# EAGLE design NinjaLAMP_Arduino (EAGLE 9.6.1)
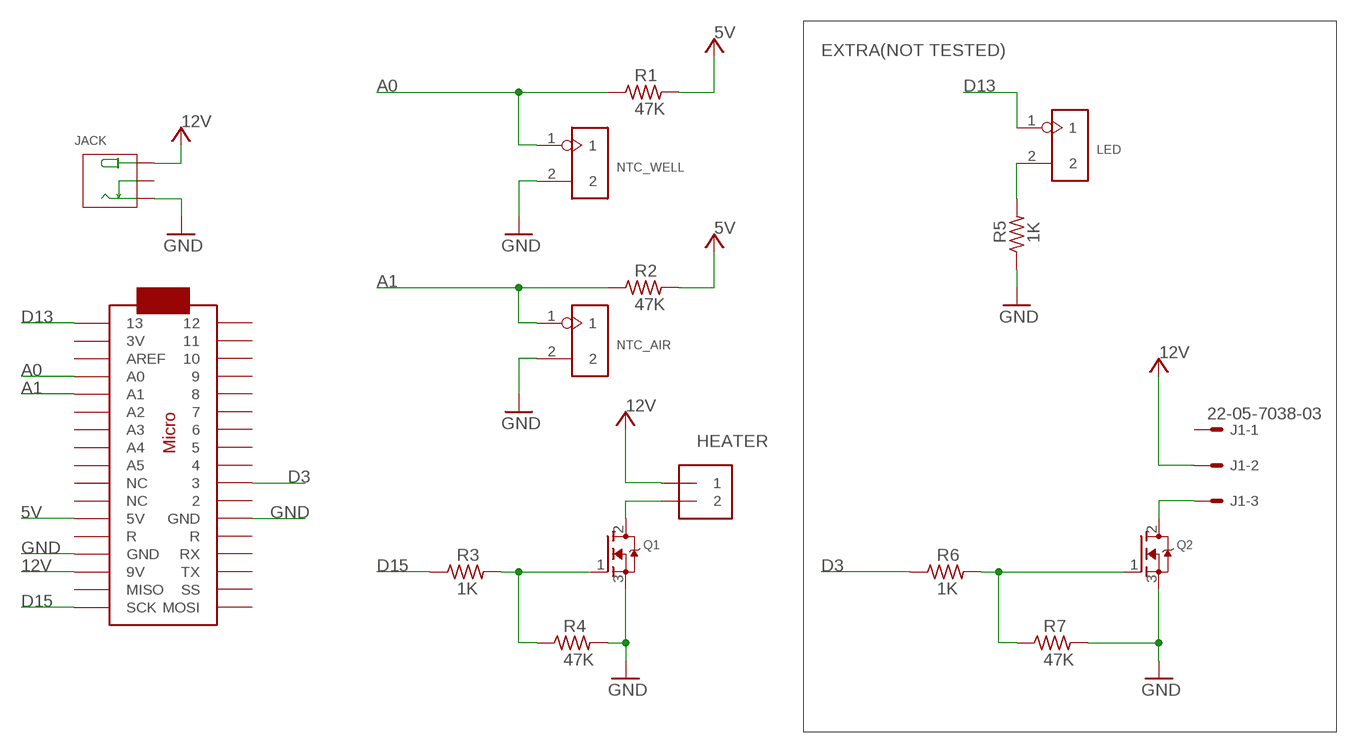
[diagram p0: schematic, sheet 1]

## Parts
HEATER  1X2-3.5MM  [1X2-3.5MM]
J1  22-05-7038-03  [7395-03]
JACK  DC-005  CONN-POWER-JACK-2.1MM(DC-005)  [DCJ3P-14.2X11.0X9.0MM]
LED  2p-2.54  DIP-BLACK-MALE-HEADER-VERT(2P-2.54)  [H2-2.54]
NTC_AIR  2p-2.54  DIP-BLACK-MALE-HEADER-VERT(2P-2.54)  [H2-2.54]
NTC_WELL  2p-2.54  DIP-BLACK-MALE-HEADER-VERT(2P-2.54)  [H2-2.54]
Q1  MOSFET-NGDS_TO220V  [TO220V]
Q2  MOSFET-NGDS_TO220V  [TO220V]
R1  47K  R-US_0204/7  [0204/7]
R2  47K  R-US_0204/7  [0204/7]
R3  1K  R-US_0204/7  [0204/7]
R4  47K  R-US_0204/7  [0204/7]
R5  1K  R-US_0204/7  [0204/7]
R6  1K  R-US_0204/7  [0204/7]
R7  47K  R-US_0204/7  [0204/7]
U$2  ARDUINOMICRO  [ARDUINOMICRO]

## Nets
5V: R1.2 R2.2 U$2.P$23(5V)
12V: HEATER.1 J1.2 JACK.+B(+) JACK.+T(+) U$2.P$20(9V)
A0: NTC_WELL.1 R1.1 U$2.P$31(A0)
A1: NTC_AIR.1 R2.1 U$2.P$30(A1)
D3: R6.1 U$2.P$10
D13: LED.1 U$2.P$34
D15: R3.1 U$2.P$18(SCK)
DRAIN: HEATER.2 Q1.2(D)
GATE: Q1.1(G) R3.2 R4.1
GND: JACK.-1B(-) JACK.-1T(-) NTC_AIR.2 NTC_WELL.2 Q1.3(S) Q2.3(S) R4.2 R5.1 R7.2 U$2.P$12(GND) U$2.P$21(GND)
N$2: LED.2 R5.2
N$3: Q2.1(G) R6.2 R7.1
N$6: J1.3 Q2.2(D)
Unconnected: J1.1 JACK.-2(CDN) JACK.-2B(CDN) U$2.P$1 U$2.P$2 U$2.P$3 U$2.P$4 U$2.P$5 U$2.P$6 U$2.P$7 U$2.P$8 U$2.P$9 U$2.P$11 U$2.P$13(R) U$2.P$14(RX) U$2.P$15(TX) U$2.P$16(SS) U$2.P$17(MOSI) U$2.P$19(MISO) U$2.P$22(R) U$2.P$24(NC) U$2.P$25(NC) U$2.P$26(A5) U$2.P$27(A4) U$2.P$28(A3) U$2.P$29(A2) U$2.P$32(AREF) U$2.P$33(3V)

## Notes on the sheet
- EXTRA(NOT TESTED)
- HEATER

## Library data of the parts
HEATER = adafruit:1X2: 3.5mm Terminal block http://www.ladyada.net/library/pcb/eaglelibrary.html
J1 = con-molex:22-?-03: CONNECTOR wire to board 2.54 mm (.1 inch) pitch header; MF: MOLEX; OC_FARNELL: unknown; OC_NEWARK: unknown
JACK = OPL_Connector:CONN-POWER-JACK-2.1MM(DC-005): Seeed SKU 320120003 - DIP Black DC Jack 2.1MM MPN: DC-005 Important Notes: This part requires milling slots. Please make sure layer 46 Milling is included in the profile or outline layer when exporting Gerber files. Alternatively, you can use the built-in Seeed Fusion CAM file. Find it under Third-Party CAM files. Seeed Fusion PCBA OPL <https://www.seeedstudio.com/opl.html> Order PCB/PCBA Now <https://www.seeedstudio.com/fusion_pcb.html> www.seeedstudio.com; MPN: DC-005
LED NTC_AIR NTC_WELL = OPL_Connector:DIP-BLACK-MALE-HEADER-VERT(2P-2.54): 320020016; MPN: P125-1102A0BS116A1
Q1 Q2 = adafruit:MOSFET-N: N-Channel Mosfet 2N7002E - 60V 260mA SOT23 [Digikey: 2N7002ET1GOSTR-ND] - REEL BSH103 - 30V 850mA SOT23 [Digikey: 568-5013-1-ND]
R1-R7 = resistor:R-US_: RESISTOR, American symbol
U$2 = adafruit:ARDUINOMICRO

## Board
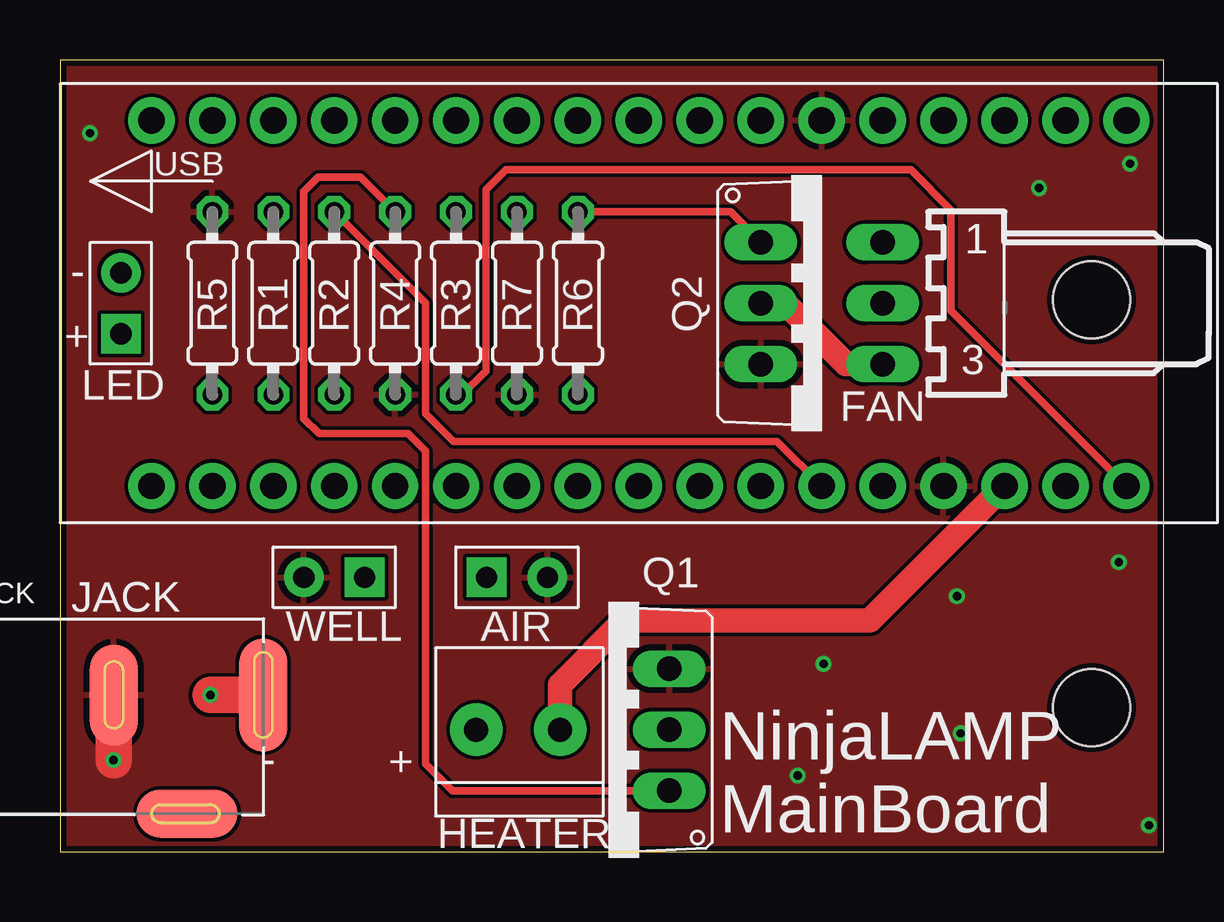
[diagram p1: board, top side]
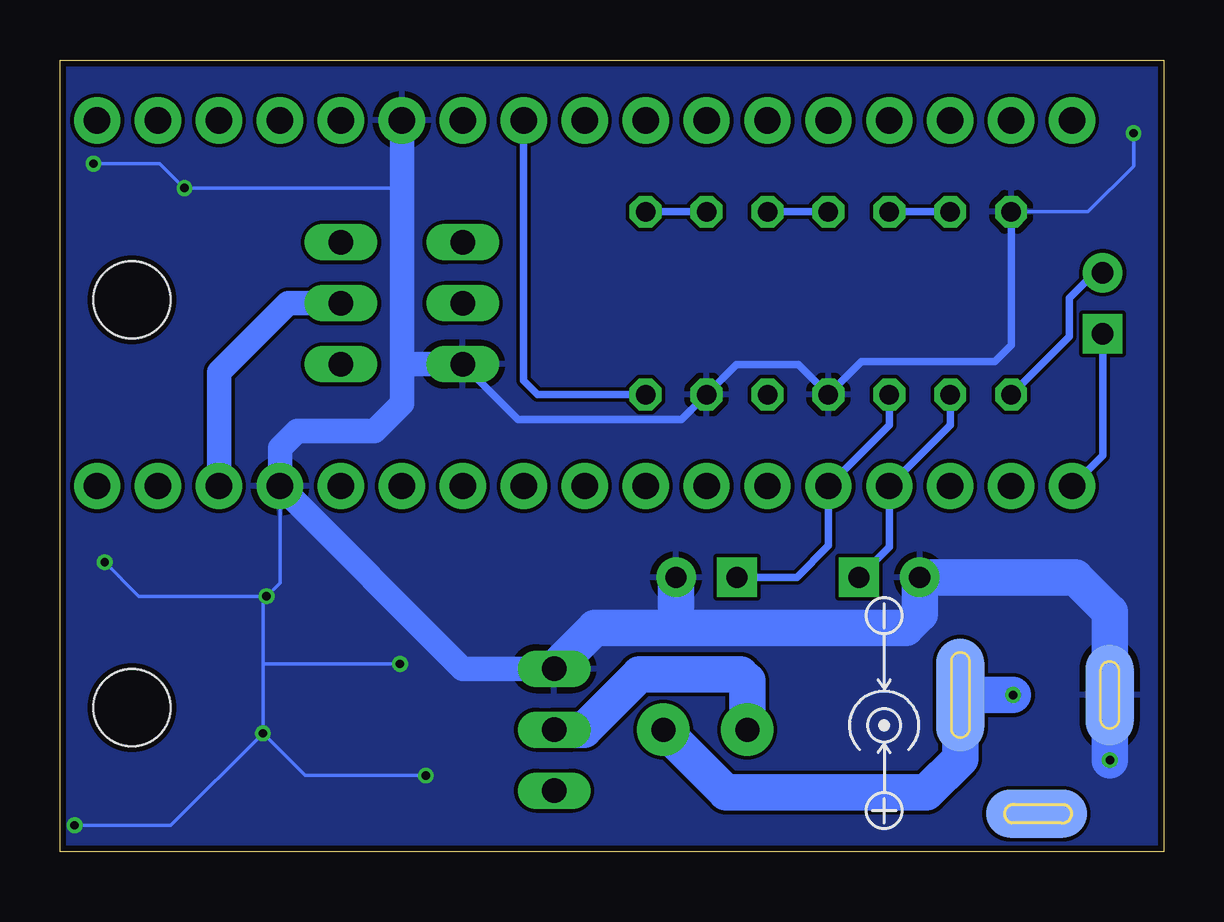
[diagram p2: board, bottom side, seen from below]

Size 46 x 33 mm. Coordinates in mm from the lower left corner, seen from the top.
Outline: 0,0 46,0 46,33 0,33 0,0
Copper layers (1*16): Top 0.035mm / dielectric 1.5mm / Bottom 0.035mm
Design rules "SeeedStudio_2layer_DRU_no_angle_20140221": minimum track width 6mil, minimum drill 12mil, track to track 6mil, track to pad 6mil, pad to pad 6mil, via to via 6mil, smd to smd 0mil, copper to edge 10mil, drill to drill 10mil, minimum pad ring 10mil, minimum via ring 6mil, stop-mask expansion 2mil, vias tented up to drill 100mil, thermal gap 10mil
Holes 3.2 mm at 43,23 43,6
tKeepout: area 39,19 to 47,27; area 39,2 to 47,10

### Footprints (pad centres in the part's own frame; a part is rotated, then mirrored left to right if it is on the bottom)
1X2-3.5MM = drill 1 pad 2.184: 1 1.8,0; 2 -1.7,0
7395-03 = drill 1.016 long: 1 2.54,0; 2 0,0; 3 -2.54,0
DCJ3P-14.2X11.0X9.0MM = smd 2 x 4.7 bottom: +B 3.175,0 | smd 2 x 4.7: +T 3.175,0 | smd 2 x 4.2 bottom: -1B -3.048,0 | smd 2 x 4.2: -1T -3.048,0 | smd 4.2 x 2: -2 0,-4.953 | smd 4.2 x 2 bottom: -2B 0,-4.953
H2-2.54 = drill 0.889 pad 1.651 square: 1 0,1.27 | drill 0.889 pad 1.651: 2 0,-1.27
TO220V = drill 1.016 long: 1 -2.54,-2.54; 2 0,-2.54; 3 2.54,-2.54
0204/7 = drill 0.813 octagon: 1 -3.81,0; 2 3.81,0
ARDUINOMICRO = drill 1.1 pad 1.93: P$1 -20.32,7.62; P$2 -17.78,7.62; P$3 -15.24,7.62; P$4 -12.7,7.62; P$5 -10.16,7.62; P$6 -7.62,7.62; P$7 -5.08,7.62; P$8 -2.54,7.62; P$9 0,7.62; P$10 2.54,7.62; P$11 5.08,7.62; P$12 12.7,-7.62; P$13 10.16,-7.62; P$14 12.7,7.62; P$15 15.24,7.62; P$16 17.78,7.62; P$17 20.32,7.62; P$18 20.32,-7.62; P$19 17.78,-7.62; P$20 15.24,-7.62; P$21 7.62,7.62; P$22 10.16,7.62; P$23 7.62,-7.62; P$24 5.08,-7.62; P$25 2.54,-7.62; P$26 0,-7.62; P$27 -2.54,-7.62; P$28 -5.08,-7.62; P$29 -7.62,-7.62; P$30 -10.16,-7.62; P$31 -12.7,-7.62; P$32 -15.24,-7.62; P$33 -17.78,-7.62; P$34 -20.32,-7.62

### Placement (x,y rotation side)
HEATER  19.05,5.08 0 top
J1  34.29,22.86 90 top
JACK  5.29,6.53 0 top
LED  2.54,22.86 180 top
NTC_AIR  19.05,11.43 90 top
NTC_WELL  11.43,11.43 270 top
Q1  22.86,5.08 90 top
Q2  31.75,22.86 270 top
R1  8.89,22.86 90 top
R2  11.43,22.86 90 top
R3  16.51,22.86 90 top
R4  13.97,22.86 270 top
R5  6.35,22.86 270 top
R6  21.59,22.86 90 top
R7  19.05,22.86 270 top
U$2  24.13,22.86 0 top

### Tracks (layer width: path | path; a pad name or v marks a point on that pad's centre or on a via)
5V
  Top 0.305: R2.2 15.24,22.86 15.24,18.26 16.41,17.09 29.9,17.09 U$2.P$23
  Bottom 0.305: R1.2 R2.2
12V  (via drill 0.35)
  Top 1.016: U$2.P$20 33.76,9.63 23.52,9.63 20.85,6.96 HEATER.1
  Top 1.524: v6.27,6.53 JACK.+B
  Bottom 1.016: J1.2 36.5,22.86 39.37,19.99 U$2.P$20
  Bottom 1.524: HEATER.1 18.23,2.46 9.88,2.46 8.47,3.87 JACK.+B v6.27,6.53
A0
  Bottom 0.305: NTC_WELL.1 11.43,12.7 U$2.P$31 8.89,17.78 R1.1
A1
  Bottom 0.305: NTC_AIR.1 15.29,11.43 13.97,12.75 U$2.P$30 11.43,17.78 R2.1
D3
  Bottom 0.305: R6.1 26.09,19.05 26.67,19.63 U$2.P$10
D13
  Bottom 0.305: U$2.P$34 2.54,16.51 LED.1
D15
  Top 0.305: U$2.P$18 37.13,22.55 37.13,26.75 35.46,28.42 18.59,28.42 17.75,27.58 17.75,20.04 16.76,19.05 R3.1
DRAIN
  Bottom 1.524: HEATER.2 17.35,7.11 17.63,7.39 21.84,7.39 24.16,5.08 Q1.2
GATE
  Top 0.305: Q1.1 16.36,2.54 15.24,3.66 15.24,16.69 14.5,17.42 10.79,17.42 10.16,18.06 10.16,27.51 10.77,28.12 12.52,28.12 R4.1
  Bottom 0.305: R4.1 R3.2
GND  (via drill 0.35)
  Top 1.524: v2.23,3.81 2.23,6.52 JACK.-1T
  Bottom 0.152: R5.1 3.15,26.67 1.25,28.57 v1.25,29.95 | v44.61,28.68 41.83,28.68 v40.82,27.66 31.85,27.66 31.75,27.56 | v44.14,12.06 42.71,10.64 v37.39,10.64 | v37.39,10.64 36.83,11.2 U$2.P$12 | v37.54,4.93 37.54,7.8 | 37.54,7.8 37.54,10.49 v37.39,10.64 | v45.39,1.09 41.38,1.09 v37.54,4.93 | v30.75,3.17 35.78,3.17 v37.54,4.93 | v31.83,7.82 37.52,7.82 37.54,7.8
  Bottom 0.305: R5.1 6.35,21.11 7.04,20.42 12.6,20.42 R4.2 15.21,20.3 17.8,20.3 R7.2 20.09,18.01 26.9,18.01 Q2.3
  Bottom 1.016: Q1.3 29.21,7.62 U$2.P$12 36.83,16.82 36.12,17.53 32.89,17.53 31.75,18.67 31.75,20.34 | U$2.P$21 31.75,27.56 31.75,20.34 | Q2.3 31.73,20.32 31.75,20.34
  Bottom 1.524: Q1.3 23.7,9.32 20.32,9.32 | 20.32,9.32 10.74,9.32 10.16,9.91 NTC_WELL.2 3.68,11.43 2.25,9.99 JACK.-1T | NTC_AIR.2 20.32,9.32 | 2.29,5.99 2.29,6.49 JACK.-1T | JACK.-1T 2.25,3.82 v2.23,3.81
  pour Bottom: -1,34 47,34 47,-1 -1,-1
  pour Top: -2,35 48,35 48,-2 -2,-2
N$2
  Bottom 0.305: R5.2 3.94,21.46 3.94,23.06 2.87,24.13 LED.2
N$3
  Top 0.305: R6.2 27.94,26.67 Q2.1
  Bottom 0.305: R7.1 R6.2
N$6
  Top 1.016: Q2.2 30.23,22.86 32.77,20.32 J1.3

### Text on the board
tPlace: USB
tNames: - | R5 | R1 | R2 | R4 | R3 | R7 | R6 | Q2 | + | LED | FAN | Q1 | JACK | WELL | AIR | - | + | NinjaLAMP / MainBoard | HEATER